# Altium schematic sheet Connector_Sheet1.SchDoc
size 420 x 297 mm; SheetNumber: 7; SheetTotal: 8
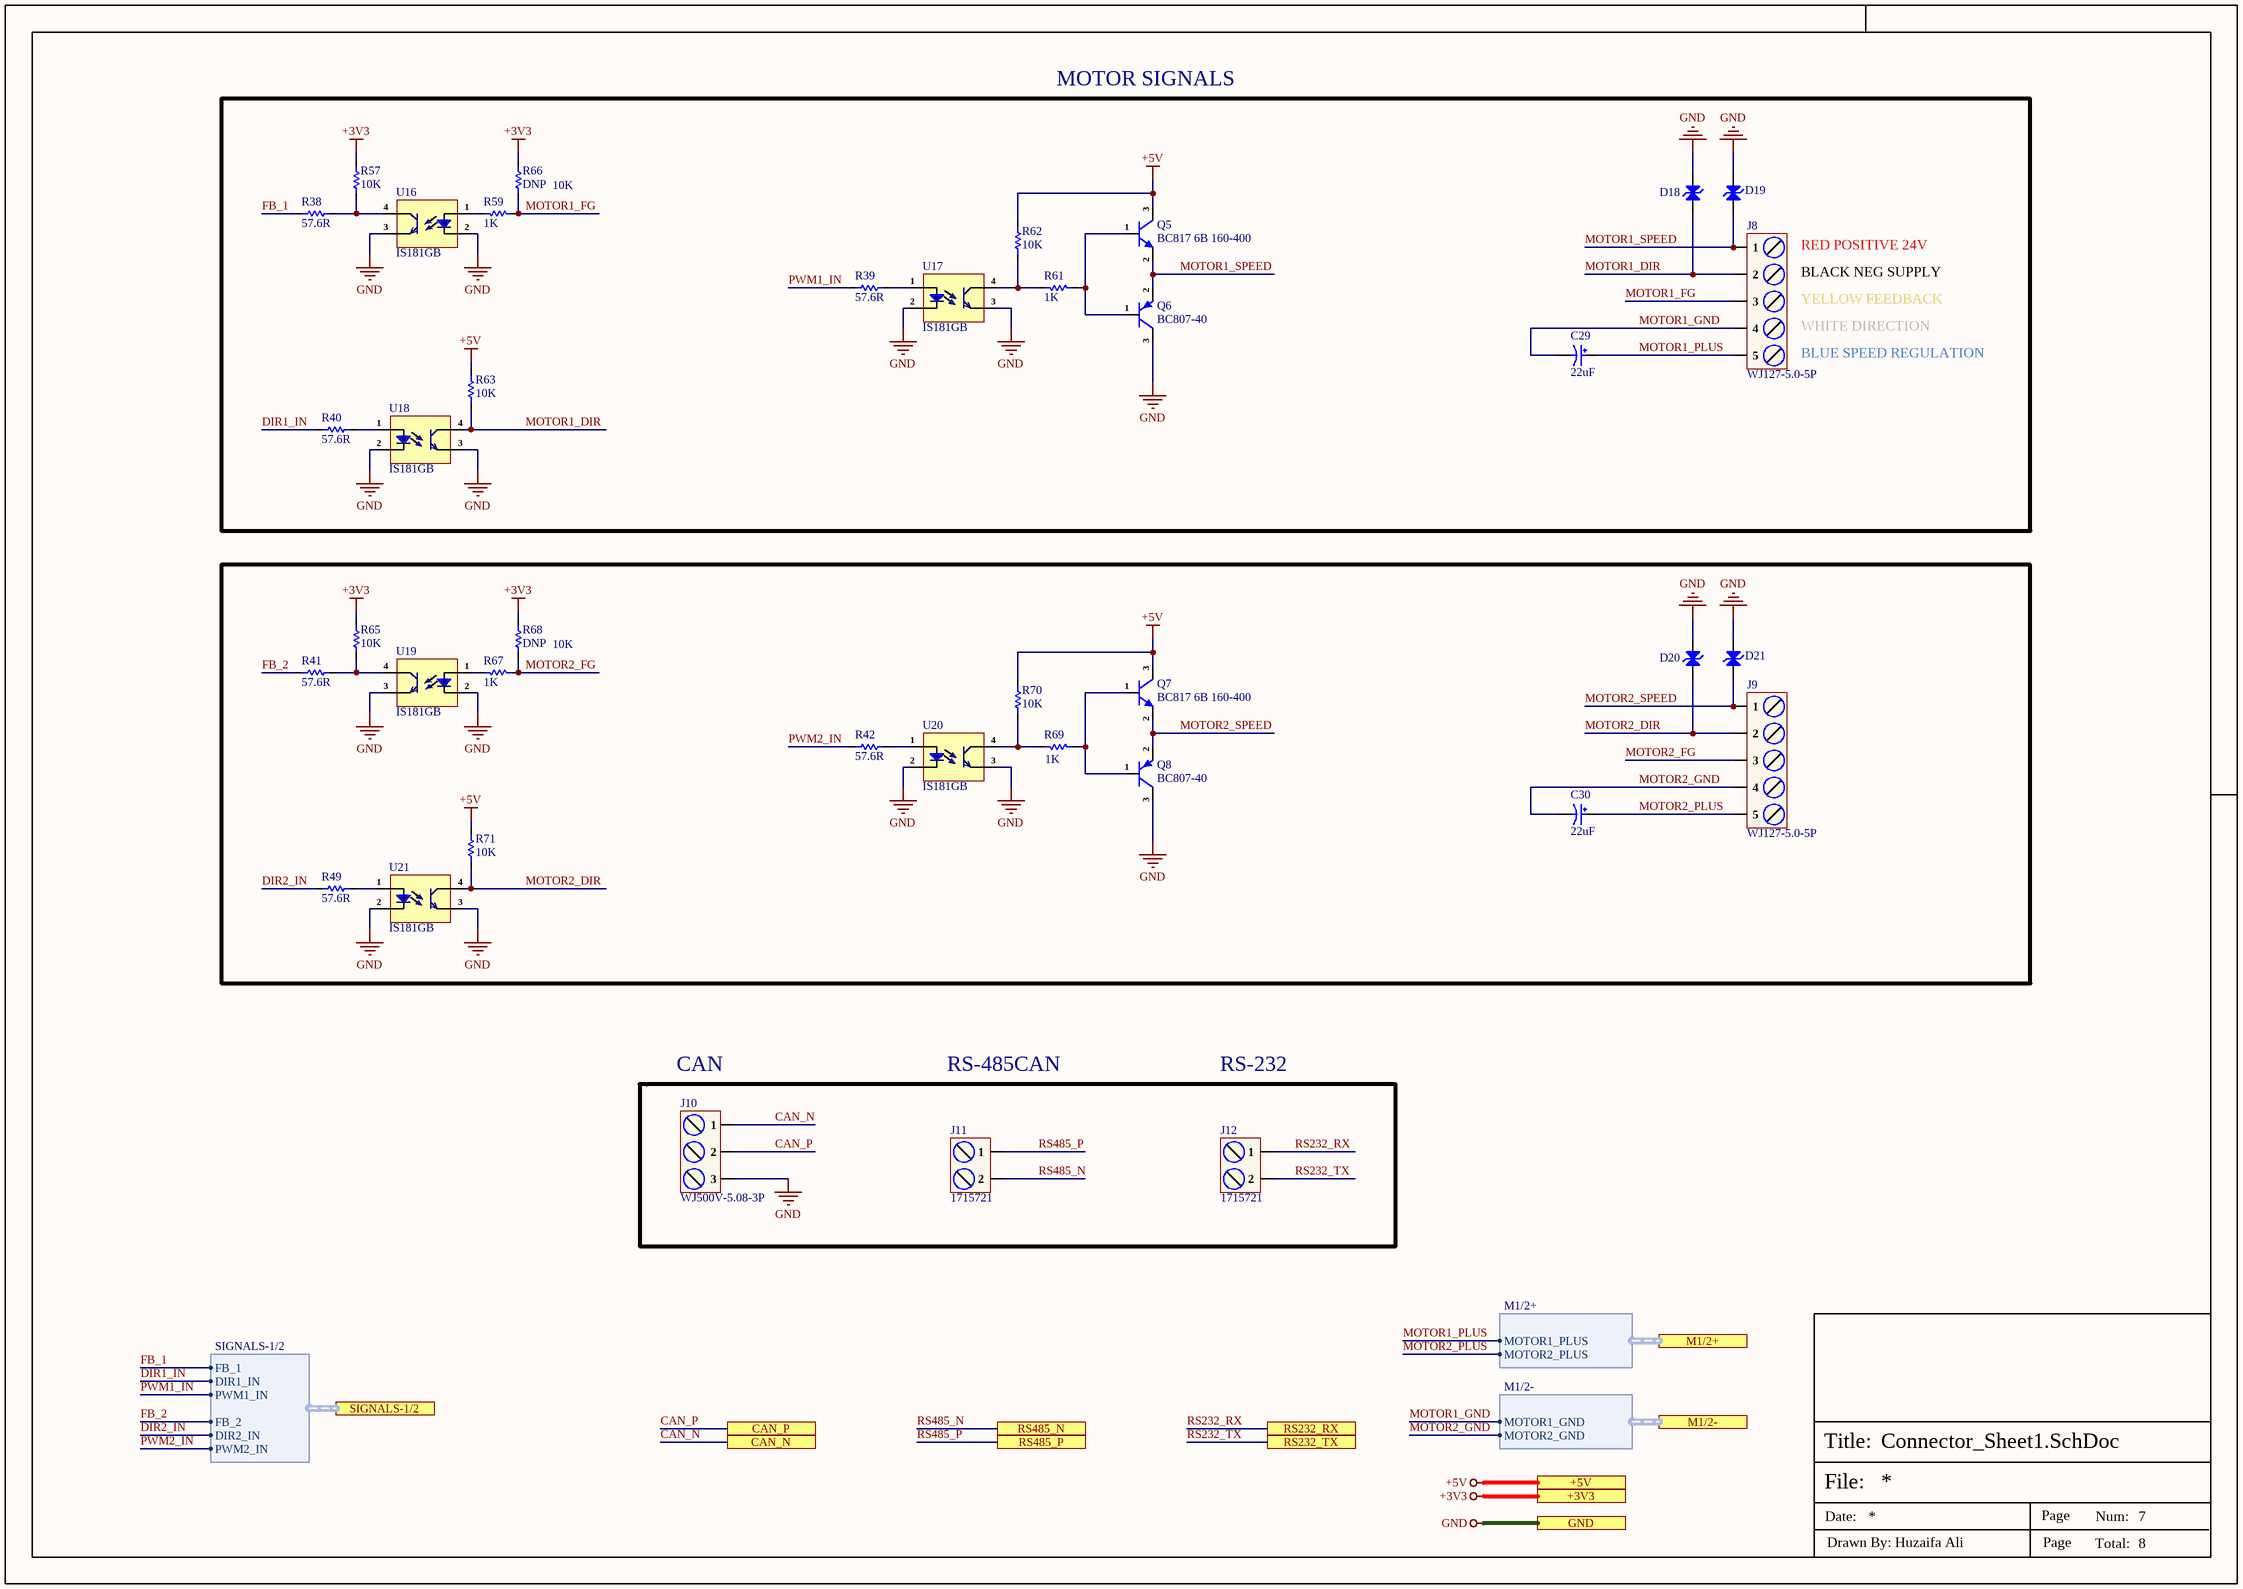
[diagram p0: Connector_Sheet1.SchDoc]

## Parts
C29  22uF  [VKMD1652D220MV]
C30  22uF  [VKMD1652D220MV]
D18  ESD5B5.0ST1G  [SOD-523]  (value not drawn)
D19  ESD5B5.0ST1G  [SOD-523]  (value not drawn)
D20  ESD5B5.0ST1G  [SOD-523]  (value not drawn)
D21  ESD5B5.0ST1G  [SOD-523]  (value not drawn)
J8  WJ127-5.0-5P  [WJ127-5.0-5P]
J9  WJ127-5.0-5P  [WJ127-5.0-5P]
J10  WJ500V-5.08-3P  [WJ500V-5.08-3P]
J11  1715721  [1715721]
J12  1715721  [1715721]
Q5  BC817 6B 160-400  [SOT-23]
Q6  BC807-40  [SOT-23]
Q7  BC817 6B 160-400  [SOT-23]
Q8  BC807-40  [SOT-23]
R38  57.6R  [Res-0402]
R39  57.6R  [Res-0402]
R40  57.6R  [Res-0402]
R41  57.6R  [Res-0402]
R42  57.6R  [Res-0402]
R49  57.6R  [Res-0402]
R57  10K  [Res-0402]
R59  1K  [Res-0402]
R61  1K  [Res-0402]
R62  10K  [Res-0402]
R63  10K  [Res-0402]
R65  10K  [Res-0402]
R66  DNP  [Res-0402]
R67  1K  [Res-0402]
R68  DNP  [Res-0402]
R69  1K  [Res-0402]
R70  10K  [Res-0402]
R71  10K  [Res-0402]
U16  IS181GB  [SOP-4_2.54]
U17  IS181GB  [SOP-4_2.54]
U18  IS181GB  [SOP-4_2.54]
U19  IS181GB  [SOP-4_2.54]
U20  IS181GB  [SOP-4_2.54]
U21  IS181GB  [SOP-4_2.54]

## Blocks framed on the sheet
10K: C30 D20 D21 J9 Q7 Q8 R41 R42 R49 R65 R67-R71 U19-U21

## Ports
+3V3 (see Top_Sheet[2A], CAN_Sheet[5D], Connector_Sheet2[3D], Controller_Sheet[2D], Motor_Driver_Sheet[5D], Power_Sheet[5D], RS485_RS232_Sheet[5D]), +5V (see Top_Sheet[2A], CAN_Sheet[5D], Connector_Sheet2[3D], Power_Sheet[5D]), CAN_N (see Top_Sheet[2B], CAN_Sheet[2D]), CAN_P (see Top_Sheet[2B], CAN_Sheet[2D]), GND (see Top_Sheet[2B], CAN_Sheet[5D], Connector_Sheet2[3D], Controller_Sheet[2D], Motor_Driver_Sheet[5D], Power_Sheet[5D], RS485_RS232_Sheet[5D]), M1/2+ (harness M1/2+, see Top_Sheet[2B], Motor_Driver_Sheet[3D]), M1/2- (harness M1/2-, see Top_Sheet[2B], Motor_Driver_Sheet[2D]), RS232_RX (see Top_Sheet[2B], RS485_RS232_Sheet[4D]), RS232_TX (see Top_Sheet[2B], RS485_RS232_Sheet[4D]), RS485_N (see Top_Sheet[2B], RS485_RS232_Sheet[4D]), RS485_P (see Top_Sheet[2B], RS485_RS232_Sheet[4D]), SIGNALS-1/2 (harness SIGNALS-1/2, see Top_Sheet[2B], Controller_Sheet[1D])

## Harnesses
M1/2+: MOTOR1_PLUS, MOTOR2_PLUS
M1/2-: MOTOR1_GND, MOTOR2_GND
SIGNALS-1/2: FB_1, DIR1_IN, PWM1_IN, FB_2, DIR2_IN, PWM2_IN

## Nets
+3V3: R57.2 R65.2 R66.2 R68.2 ; port +3V3
+5V: Q5.3(C) Q7.3(C) R62.1 R63.2 R70.1 R71.2 ; port +5V
GND: D18.2(A) D19.2(A) D20.2(A) D21.2(A) J10.3 Q6.3(C) Q8.3(C) U16.2(Ca) U16.3(E) U17.2(Ca) U17.3(E) U18.2(Ca) U18.3(E) U19.2(Ca) U19.3(E) U20.2(Ca) U20.3(E) U21.2(Ca) U21.3(E) ; port GND
CAN_N: J10.1 ; port CAN_N
CAN_P: J10.2 ; port CAN_P
DIR1_IN: R40.1 ; port SIGNALS-1/2.DIR1_IN
DIR2_IN: R49.1 ; port SIGNALS-1/2.DIR2_IN
FB_1: R38.1 ; port SIGNALS-1/2.FB_1
FB_2: R41.1 ; port SIGNALS-1/2.FB_2
MOTOR1_DIR: D18.1(A) J8.2 R63.1 U18.4(C)
MOTOR1_FG: J8.3 R59.1 R66.1
MOTOR1_GND: C29.2 J8.4 ; port M1/2-.MOTOR1_GND
MOTOR1_PLUS: C29.1 J8.5 ; port M1/2+.MOTOR1_PLUS
MOTOR1_SPEED: D19.1(A) J8.1 Q5.2(E) Q6.2(E)
MOTOR2_DIR: D20.1(A) J9.2 R71.1 U21.4(C)
MOTOR2_FG: J9.3 R67.1 R68.1
MOTOR2_GND: C30.2 J9.4 ; port M1/2-.MOTOR2_GND
MOTOR2_PLUS: C30.1 J9.5 ; port M1/2+.MOTOR2_PLUS
MOTOR2_SPEED: D21.1(A) J9.1 Q7.2(E) Q8.2(E)
PWM1_IN: R39.1 ; port SIGNALS-1/2.PWM1_IN
PWM2_IN: R42.1 ; port SIGNALS-1/2.PWM2_IN
RS232_RX: J12.1 ; port RS232_RX
RS232_TX: J12.2 ; port RS232_TX
RS485_N: J11.2 ; port RS485_N
RS485_P: J11.1 ; port RS485_P
NetQ5_1: Q5.1(B) Q6.1(B) R61.1
NetQ7_1: Q7.1(B) Q8.1(B) R69.1
NetR38_2: R38.2 R57.1 U16.4(C)
NetR39_2: R39.2 U17.1(An)
NetR40_2: R40.2 U18.1(An)
NetR41_2: R41.2 R65.1 U19.4(C)
NetR42_2: R42.2 U20.1(An)
NetR49_2: R49.2 U21.1(An)
NetR59_2: R59.2 U16.1(An)
NetR61_2: R61.2 R62.2 U17.4(C)
NetR67_2: R67.2 U19.1(An)
NetR69_2: R69.2 R70.2 U20.4(C)

## Notes on the sheet
- MOTOR SIGNALS
- 10K
- RED POSITIVE 24V
- BLACK NEG SUPPLY
- YELLOW FEEDBACK
- WHITE DIRECTION
- BLUE SPEED REGULATION
- (near J10) CAN
- RS-485CAN
- RS-232
- File:
- Title:
- Date:
- Page
- Num:
- Total:
- Drawn By: Huzaifa Ali

## Library data of the parts
C29 C30 = VKMD1652D220MV: 22uF 200V 320mA@100kHz ±20% SMD,D8xL16.5mm Aluminum Electrolytic Capacitors - SMD ROHS; Manufacturer: Ymin; Manufacturer Part Number: VKMD1652D220MV; Package: SMD,D8xL16.5mm; LCSC Part Number: C487500; Item Type: Electrolytic Capacitor; ComponentLink1Description: LCSC; ComponentLink1URL: https://www.lcsc.com/product-detail/Aluminum-Electrolytic-Capacitors-SMD_Ymin-VKMD1652D220MV_C487500.html
D18-D21 = ESD5B5.0ST1G: TVS DIODE 5VWM SOD523; Manufacturer: ON Semiconductor; Item Type: ESD Protection Device; Supplier: Future Electronics; Supplier Part Number: 1159725; Manufacturer Part Number: ESD5B5.0ST1G; RoHS: Yes; Category: ESD and Circuit Protection ICs; Stock: 486000; Pricing: 3000=0.0396, 9000=0.0381, 15000=0.0375, 60000=0.0357, 90000=0.0346 (USD); ComponentLink1URL: https://datasheet.ciiva.com/339/esd5b5-0st1g-339772.pdf?src-supplier=Avnet; ComponentLink1Description: https://datasheet.ciiva.com/339/esd5b5-0st1g-339772.pdf?src-supplier=Avnet; ComponentLink2URL: https://datasheet.ciiva.com/339/esd5b5-0st1g-339772.pdf?src-supplier=Digi-Key; ComponentLink2Description: https://datasheet.ciiva.com/339/esd5b5-0st1g-339772.pdf?src-supplier=Digi-Key; ComponentLink3URL: https://datasheet.ciiva.com/22637/716649-22637178.pdf?src-supplier=Element14; ComponentLink3Description: https://datasheet.ciiva.com/22637/716649-22637178.pdf?src-supplier=Element14; ComponentLink4URL: https://datasheet.ciiva.com/4510/esd5b5-0st1g-241623-4510548.pdf?src-supplier=Mouser; ComponentLink4Description: https://datasheet.ciiva.com/4510/esd5b5-0st1g-241623-4510548.pdf?src-supplier=Mouser; ComponentLink5URL: https://datasheet.ciiva.com/339/esd5b5-0st1-d-339773.pdf?src-supplier=Digi-Key; ComponentLink5Description: https://datasheet.ciiva.com/339/esd5b5-0st1-d-339773.pdf?src-supplier=Digi-Key; ComponentLink6URL: https://datasheet.ciiva.com/339/esd5b5-0st1-d-339774.pdf?src-supplier=Digi-Key; ComponentLink6Description: https://datasheet.ciiva.com/339/esd5b5-0st1-d-339774.pdf?src-supplier=Digi-Key; LCSC Part Number: C93623
J8 J9 = WJ127-5.0-5P: 1x5P -40℃~+105℃ 15A 250V Green 14~26 Straight pin 5mm 1.5 1 5 Plugin,P=5mm Screw terminal ROHS; Manufacturer: Ningbo Kangnex Elec; ComponentLink1Description: LCSC; ComponentLink1URL: https://www.lcsc.com/product-detail/Screw-terminal_Ningbo-Kangnex-Elec-WJ127-5-0-5P_C192780.html; Manufacturer Part Number: WJ127-5.0-5P; Package: Plugin,P=5mm; LCSC Part Number: C192780; Item Type: Screw terminal
J10 = WJ500V-5.08-3P: 1x3P 18A -40℃~+105℃ 250V Green 14~30 Straight pin 5.08mm 2.5 1 3 Plugin,P=5.08mm Screw terminal ROHS; Manufacturer: Ningbo Kangnex Elec; Item Type: Terminal Block; Manufacturer Part Number: WJ500V-5.08-3P; Package: Plugin,P=5.08mm; LCSC Part Number: C72334; ComponentLink1Description: LCSC; ComponentLink1URL: https://www.lcsc.com/product-detail/Screw-terminal_Ningbo-Kangnex-Elec-WJ500V-5-08-3P_C72334.html
J11 J12 = 1715721: TERM BLK 2P SIDE ENT 5.08MM PCB; Manufacturer: Phoenix Contact; Item Type: Terminal Blocks; Supplier: Digikey; Supplier Part Number: 277-1263-ND; Manufacturer Part Number: 1715721; RoHS: Yes; Stock: 13160; Pricing: 1=0.94 (USD); ComponentLink1URL: https://datasheet.ciiva.com/1120/1697161-1120393.pdf?src-supplier=Farnell; ComponentLink1Description: https://datasheet.ciiva.com/1120/1697161-1120393.pdf?src-supplier=Farnell; ComponentLink2URL: https://datasheet.ciiva.com/832/1715721-832095.pdf?src-supplier=Digikey; ComponentLink2Description: https://datasheet.ciiva.com/832/1715721-832095.pdf?src-supplier=Digikey; ComponentLink3URL: https://datasheet.ciiva.com/15169/getdatasheetpartid-212174-15169929.pdf?src-supplier=Verical; ComponentLink3Description: https://datasheet.ciiva.com/15169/getdatasheetpartid-212174-15169929.pdf?src-supplier=Verical; ComponentLink4URL: https://datasheet.ciiva.com/16046/1715721-16046034.pdf?src-supplier=Onlinecomponents.com; ComponentLink4Description: https://datasheet.ciiva.com/16046/1715721-16046034.pdf?src-supplier=Onlinecomponents.com
Q5 Q7 = BC817 6B 160-400: 45V 300mW 100@100mA,1V 500mA NPN SOT-23 Bipolar Transistors - BJT ROHS; Manufacturer: DOWO; Manufacturer Part Number: BC817 6B 160-400; Package: SOT-23; LCSC Part Number: C371086; Item Type: Transistor; ComponentLink1Description: LCSC; ComponentLink1URL: https://www.lcsc.com/product-detail/Bipolar-Transistors-BJT_DOWO-BC817-6B-160-400_C371086.html
Q6 Q8 = BC807-40: 45V 310mW 250@100mA,1V 800mA SOT-23 Bipolar (BJT) ROHS; Manufacturer: KEXIN; Item Type: (BJT); Manufacturer Part Number: BC807-40; Package: SOT-23; LCSC Part Number: C489159; ComponentLink1Description: LCSC; ComponentLink1URL: https://www.lcsc.com/product-detail/Bipolar-BJT_KEXIN-BC807-40_C489159.html
R38-R42 R49 = ERJ-2RKF57R6X: RES SMD 57.6 OHM 1% 1/10W 0402; Manufacturer: Panasonic; Item Type: Resistors; Supplier: Mouser; Supplier Part Number: 667-ERJ-2RKF57R6X; Manufacturer Part Number: ERJ-2RKF57R6X; RoHS: Yes; Stock: 32931; Pricing: 1=0.1, 10=0.015, 50=0.015, 100=0.009, 1000=0.006, 10000=0.003 (USD); ComponentLink1URL: https://datasheet.ciiva.com/9188/aoa0000ce2-9188571.pdf?src-supplier=Avnet; ComponentLink1Description: https://datasheet.ciiva.com/9188/aoa0000ce2-9188571.pdf?src-supplier=Avnet; ComponentLink2URL: https://datasheet.ciiva.com/9188/aoa0000ce2-9188574.pdf?src-supplier=Avnet; ComponentLink2Description: https://datasheet.ciiva.com/9188/aoa0000ce2-9188574.pdf?src-supplier=Avnet; ComponentLink3URL: https://datasheet.ciiva.com/24026/aoa0000ce2-24026248.pdf?src-supplier=Mouser; ComponentLink3Description: https://datasheet.ciiva.com/24026/aoa0000ce2-24026248.pdf?src-supplier=Mouser; ComponentLink4URL: https://datasheet.ciiva.com/43467/1678782-43467198.pdf?src-supplier=Farnell; ComponentLink4Description: https://datasheet.ciiva.com/43467/1678782-43467198.pdf?src-supplier=Farnell; ComponentLink5URL: https://datasheet.ciiva.com/46372/1678782-46372935.pdf?src-supplier=Element14; ComponentLink5Description: https://datasheet.ciiva.com/46372/1678782-46372935.pdf?src-supplier=Element14; ComponentLink6URL: https://datasheet.ciiva.com/46372/1678782-46372936.pdf?src-supplier=Element14; ComponentLink6Description: https://datasheet.ciiva.com/46372/1678782-46372936.pdf?src-supplier=Element14; ComponentLink7URL: https://datasheet.ciiva.com/22668/1678782-22668391.pdf?src-supplier=Element14; ComponentLink7Description: https://datasheet.ciiva.com/22668/1678782-22668391.pdf?src-supplier=Element14; ComponentLink8URL: https://datasheet.ciiva.com/22743/1678782-22743894.pdf?src-supplier=Element14; ComponentLink8Description: https://datasheet.ciiva.com/22743/1678782-22743894.pdf?src-supplier=Element14; ComponentLink9URL: https://datasheet.ciiva.com/30107/aoa0000ce2-30107676.pdf?src-supplier=Onlinecomponents.com; ComponentLink9Description: https://datasheet.ciiva.com/30107/aoa0000ce2-30107676.pdf?src-supplier=Onlinecomponents.com; LCSC Part Number: C3025671
R57 R62 R63 R65 R66 R68 R70 R71 = RC0402FR-0710KL: RES 10K OHM 1% 1/16W 0402; Manufacturer: Yageo; Resistance: 10kR; Voltage Rating (DC): 50V; Temperature Coefficient: 100ppm/°C; Power Rating: 62.5mW; Max Power Dissipation: 63mW; Item Type: Resistor; Supplier 1: Mouser; Manufacturer Part Number: RC0402FR-0710KL; RoHS: Yes; Category: Chip SMD Resistors; Stock 1: 18648329; Pricing 1: 1=0.10000, 10=0.01400, 50=0.01400, 100=0.00500, 1000=0.00300, 10000=0.00200 (USD); Case/Package: 0402; Number of Pins: 2; Case Code (Imperial): 0402; Case Code (Metric): 1005; Min Operating Temperature: -55°C; Max Operating Temperature: 155°C; Resistor Type: Thick Film; Tolerance: 1%; Packaging: Tape and Reel; Voltage Rating: 50V; Termination: SMD/SMT; Working Voltage: 50V; Number of Terminations: 2; Features: Moisture Resistant; Series: RC; Resistance Tolerance: 1%; Construction: Rectangular; Length: 1mm; Width: 0.5mm; Height: 0.32mm; Depth: 0.5mm; Lead Pitch: 0.2mm; REACH SVHC: No SVHC; Lead Free: Lead Free; RoHS Compliant: Yes; Military Standard: Not; ComponentLink1URL: https://datasheet.ciiva.com/7660/38568-7660787.pdf?src-supplier=Element14; ComponentLink1Description: https://datasheet.ciiva.com/7660/38568-7660787.pdf?src-supplier=Element14; ComponentLink2URL: https://datasheet.ciiva.com/7849/1686128-7849814.pdf?src-supplier=Element14; ComponentLink2Description: https://datasheet.ciiva.com/7849/1686128-7849814.pdf?src-supplier=Element14; ComponentLink3URL: https://datasheet.ciiva.com/7983/1018594-7983486.pdf?src-supplier=Element14; ComponentLink3Description: https://datasheet.ciiva.com/7983/1018594-7983486.pdf?src-supplier=Element14; ComponentLink4URL: https://datasheet.ciiva.com/22747/1018594-22747512.pdf?src-supplier=Element14; ComponentLink4Description: https://datasheet.ciiva.com/22747/1018594-22747512.pdf?src-supplier=Element14; ComponentLink5URL: https://datasheet.ciiva.com/12667/pyu-rc0402-51-rohs-l-6-r-12667067.pdf?src-supplier=Mouser; ComponentLink5Description: https://datasheet.ciiva.com/12667/pyu-rc0402-51-rohs-l-6-r-12667067.pdf?src-supplier=Mouser; ComponentLink6URL: https://datasheet.ciiva.com/7849/1784430-7849813.pdf?src-supplier=Element14; ComponentLink6Description: https://datasheet.ciiva.com/7849/1784430-7849813.pdf?src-supplier=Element14; ComponentLink7URL: https://datasheet.ciiva.com/7849/1784430-7849815.pdf?src-supplier=Element14; ComponentLink7Description: https://datasheet.ciiva.com/7849/1784430-7849815.pdf?src-supplier=Element14; Supplier Part Number 1: 603-RC0402FR-0710KL; LCSC Part Number: C60490
R59 R61 R67 R69 = CRCW04021K00FKEDHP: RES SMD 1K OHM 1% 1/5W 0402; Manufacturer: Vishay Dale; Resistance: 1kR; Temperature Coefficient: 100ppm/°C; Power Rating: 125mW; Voltage Rating: 50V; Supplier 1: Digi-Key; Manufacturer Part Number: CRCW04021K00FKEDHP; Stock 1: 315989; Pricing 1: 1=0.15, 10=0.132, 100=0.0506, 1000=0.02226, 2500=0.01923, 5000=0.0172 (USD); Mount: Surface Mount; Case/Package: 0402; Number of Pins: 2; Contact Plating: Tin; Weight: 2.3E-05oz; Case Code (Imperial): 0402; Case Code (Metric): 1005; Size Code: 0402; Min Operating Temperature: -55°C; Max Operating Temperature: 155°C; Tolerance: 1%; Resistor Type: Thick Film; Package Quantity: 10; Packaging: Tape and Reel; Number of Terminations: 2; Termination: SMD/SMT; Max Power Dissipation: 125mW; Voltage Rating (DC): 50V; Features: Automotive AEC-Q200; Series: CRCW-HP; Construction: Rectangular; Technology: THICK FILM; Resistance Tolerance: 1%; Length: 1mm; Width: 0.5mm; Height: 0.3mm; Depth: 0.5mm; Radiation Hardening: No; REACH SVHC: Unknown; Military Standard: Not; Lead Free: Lead Free; RoHS Compliant: Yes; ComponentLink1URL: http://www.farnell.com/datasheets/2339608.pdf?src-supplier=Element14; ComponentLink1Description: http://www.farnell.com/datasheets/2339608.pdf?src-supplier=Element14; ComponentLink2URL: http://www.vishay.com/docs/20043/crcwhpe3.pdf?src-supplier=Digi-Key; ComponentLink2Description: http://www.vishay.com/docs/20043/crcwhpe3.pdf?src-supplier=Digi-Key; ComponentLink3URL: http://www.mouser.com/ds/2/427/crcwhpe3-46056.pdf?src-supplier=Mouser; ComponentLink3Description: http://www.mouser.com/ds/2/427/crcwhpe3-46056.pdf?src-supplier=Mouser; ComponentLink4URL: http://www.vishay.com/docs/20043/crcwhpe3.pdf?src-supplier=Avnet; ComponentLink4Description: http://www.vishay.com/docs/20043/crcwhpe3.pdf?src-supplier=Avnet; ComponentLink5URL: http://www.vishay.com/docs/20043/crcwhpe3.pdf?src-supplier=Future+Electronics; ComponentLink5Description: http://www.vishay.com/docs/20043/crcwhpe3.pdf?src-supplier=Future+Electronics; Supplier Part Number 1: 541-1.00KYCT-ND; LCSC Part Number: C313354
U16-U21 = IS181GB: Optoisolator Transistor Output 3750Vrms 1 Channel; Manufacturer: Isocom; Forward Current: 50mA; Reverse Breakdown Voltage: 6V; Isolation Voltage: 3.75kV; Rise Time: 18000ns; Power Dissipation: 170mW; Number of Elements: 1; Collector Emitter Saturation Voltage: 200mV; Forward Voltage: 1.4V; Collector Emitter Voltage (VCEO): 80V; Current Transfer Ratio: 600%; Item Type: Optocoupler; Supplier 1: Arrow Electronics; Manufacturer Part Number: IS181GB; RoHS: Yes; Category: Optocouplers; Stock 1: 2922; Pricing 1: 1=0.55080, 10=0.34190, 25=0.33860, 50=0.33530, 100=0.19360, 250=0.19160, 500=0.18960, 1000=0.14750 (USD); Mount: Surface Mount; Case/Package: SMD/SMT; Number of Pins: 4; Min Operating Temperature: -55°C; Max Operating Temperature: 100°C; Fall Time: 18000ns; Radiation Hardening: No; Lead Free: Lead Free; RoHS Compliant: Yes; ComponentLink1URL: https://datasheet.ciiva.com/26895/getdatasheetpartid-624485-26895717.pdf?src-supplier=Verical; ComponentLink1Description: https://datasheet.ciiva.com/26895/getdatasheetpartid-624485-26895717.pdf?src-supplier=Verical; ComponentLink2URL: https://datasheet.ciiva.com/29301/183289-da-01-en-optokoppler-is181-gb-29301106.pdf?src-supplier=Conrad; ComponentLink2Description: https://datasheet.ciiva.com/29301/183289-da-01-en-optokoppler-is181-gb-29301106.pdf?src-supplier=Conrad; Supplier Part Number 1: IS181GB; LCSC Part Number: C84196